# EAGLE design ch340g-esp32 (EAGLE 9.6.2)
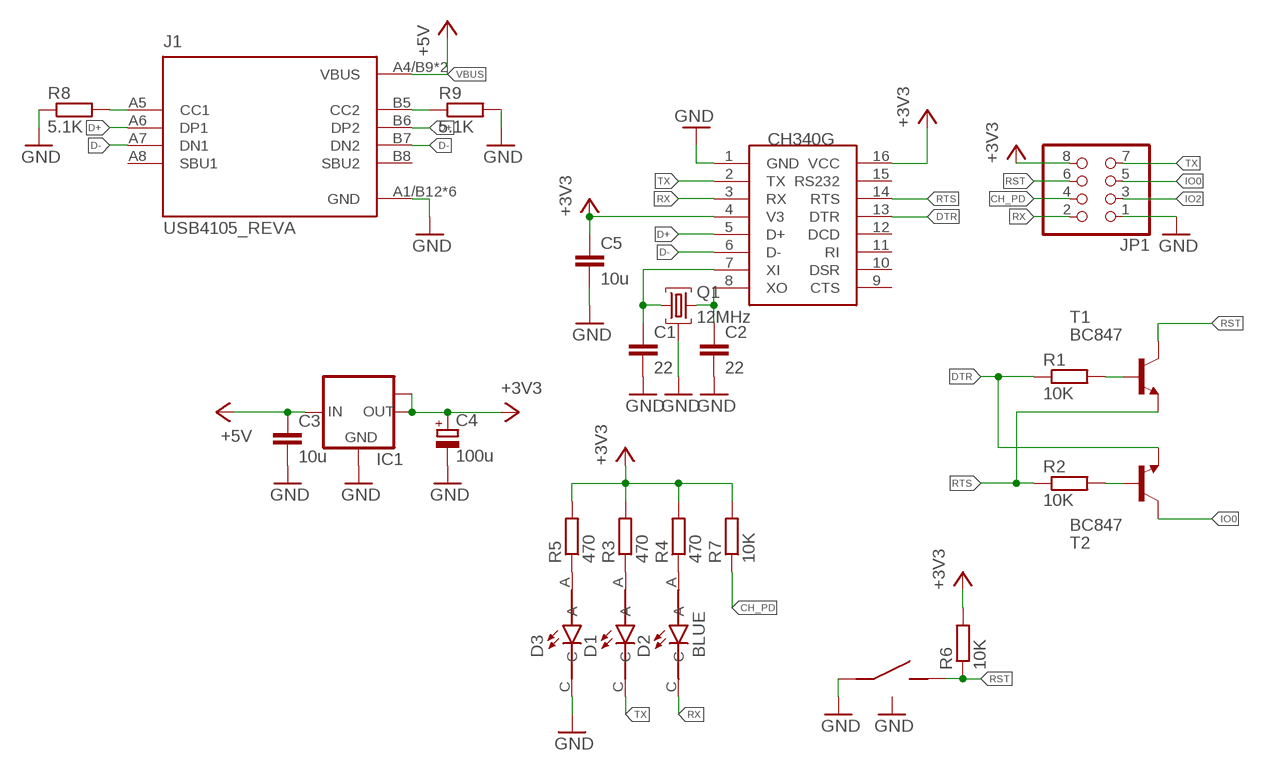
[diagram p0: schematic, sheet 1]

## Parts
BTN1  TS36CA-0.7  [SMD]
C1  22  C-EUC0603  [C0603]
C2  22  C-EUC0603  [C0603]
C3  10u  C-EUC0603  [C0603]
C4  100u  CPOL-EUB/3528-21W  [B/3528-21W]
C5  10u  C-EUC0603  [C0603]
D1  BLUE  597-5311-402F  [LEDC2012X70N]
D2  BLUE  597-5311-402F  [LEDC2012X70N]
D3  GREEN  597-5311-402F  [LEDC2012X70N]
IC1  LM1117MPX-3.3  [SOT223]
J1  USB4105_REVA  [GCT_USB4105_REVA]
JP1  PINHD-2X4  [2X04]
Q1  12MHz  YSX321SL  [SMD3225]
R1  10K  R-EU_R0603  [R0603]
R2  10K  R-EU_R0603  [R0603]
R3  470  R-EU_R0603  [R0603]
R4  470  R-EU_R0603  [R0603]
R5  470  R-EU_R0603  [R0603]
R6  10K  R-EU_R0603  [R0603]
R7  10K  R-EU_R0603  [R0603]
R8  5.1K  R-EU_R0603  [R0603]
R9  5.1K  R-EU_R0603  [R0603]
T1  BC847  [SOT23]
T2  BC847  [SOT23]
U1  CH340G  [SOIC16]

## Nets
+3V3 [VCC]: C4.+ C5.1 IC1.2(OUT) IC1.TAB(OUT1) JP1.8 R3.2 R4.2 R5.2 R6.2 R7.2 U1.4(V3) U1.16(VCC)
CH_PD: JP1.4 R7.1
D+: J1.A6(DP1) J1.B6(DP2) U1.5(D+)
D-: J1.A7(DN1) J1.B7(DN2) U1.6(D-)
DTR: R1.1 T2.2(E) U1.13(DTR)
GND [GND]: BTN1.A(CASE) BTN1.B(CASE) BTN1.C C1.2 C2.2 C3.2 C4.- C5.2 D3.C IC1.1(GND) J1.A1/B12(GND) J1.B1/A12(GND) J1.G1(GND) J1.G2(GND) J1.G3(GND) J1.G4(GND) JP1.1 Q1.P$2(CASE) Q1.P$4(CASE) R8.1 R9.2 U1.1(GND)
IO0: JP1.5 T2.3(C)
IO2: JP1.3
N$1: C2.1 Q1.P$3 U1.8(XO)
N$2: C1.1 Q1.P$1 U1.7(XI)
N$3: R1.2 T1.1(B)
N$4: R2.2 T2.1(B)
N$5: D1.A R3.1
N$6: D3.A R5.1
N$7: J1.A5(CC1) R8.2
N$8: J1.B5(CC2) R9.1
N$12: D2.A R4.1
RST: BTN1.D JP1.6 R6.1 T1.3(C)
RTS: R2.1 T1.2(E) U1.14(RTS)
RX: D2.C JP1.2 U1.3(RX)
TX: D1.C JP1.7 U1.2(TX)
VBUS [VCC]: C3.1 IC1.3(IN) J1.A4/B9(VBUS) J1.B4/A9(VBUS) ; supply symbol labelled +5V
Unconnected: J1.A8(SBU1) J1.B8(SBU2) U1.9(CTS) U1.10(DSR) U1.11(RI) U1.12(DCD) U1.15(RS232)

## Library data of the parts
BTN1 = SMD Tact:TS36CA-0.7: SHOU HAN TS36CA-0.7; LCSC#: C412365; MF: SHOU HAN; MP: TS36CA-0.7
C1-C3 C5 = rcl:C-EU: CAPACITOR, European symbol; SPICEPREFIX: C
C4 = rcl:CPOL-EU: POLARIZED CAPACITOR, European symbol; SPICEPREFIX: C
D1-D3 = 597-5311-402F:597-5311-402F: LED Uni-Color Green 560nm 2-Pin Chip 0805(2012Metric) Strip; AVAILABILITY: Unavailable; DESCRIPTION: LED Uni-Color Green 560nm 2-Pin Chip 0805_2012Metric_ Tape; MF: Dialight; MP: 597-5311-402F; PACKAGE: 0805 Dialight; PRICE: None
IC1 = lm1117:LM1117MPX-*
J1 = USB4105_REVA:USB4105_REVA: USB Type C Receptacle for USB 2.0 SMT Type, PCB Top Mount; AVAILABILITY: Unavailable; DESCRIPTION: USB-C (USB TYPE-C) USB 2.0 Receptacle Connector 24 (16+8 Dummy) Position Surface Mount, Right Angle; Through Hole; MF: Global Connector Technology; MP: USB4105; PACKAGE: Package; PRICE: None
JP1 = pinhead:PINHD-2X4: PIN HEADER
Q1 = crystal:YSX321SL: SMD Crystal Resonator Yangxing Tech X322512MSB4SI Passive SMD Crystal; MF: Yangxing Tech; MP: X322512MSB4SI; PACKAGE: SMD3225
R1-R9 = rcl:R-EU_: RESISTOR, European symbol; SPICEPREFIX: R
T1 T2 = transistor:BC847: NPN TRANSISTOR
U1 = ch340g:CH340G

## Net classes
0 default: width 0.25 mm
1 GND: width 0.4 mm
2 VCC: width 0.4 mm

## Board
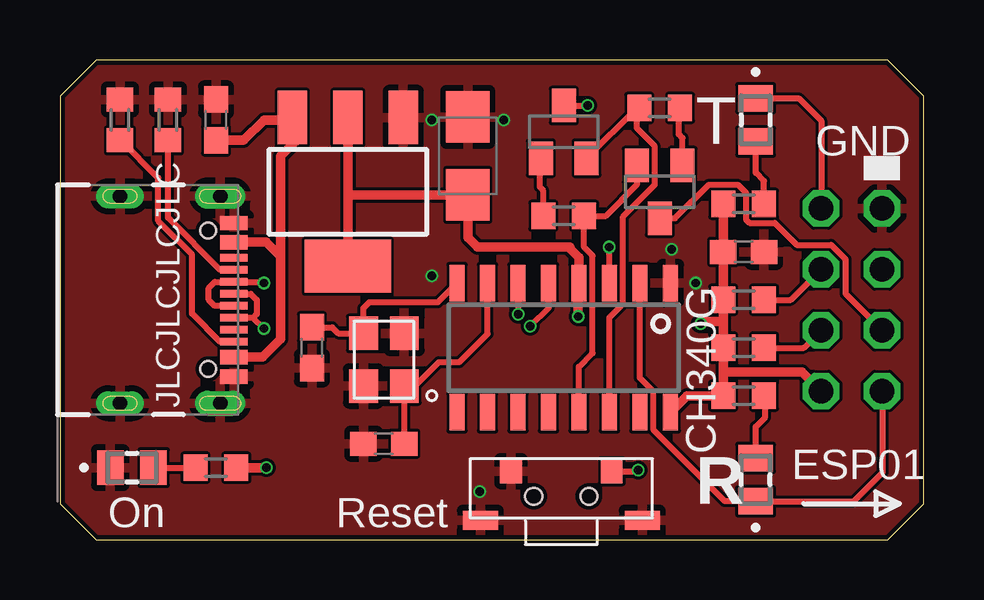
[diagram p1: board, top side]
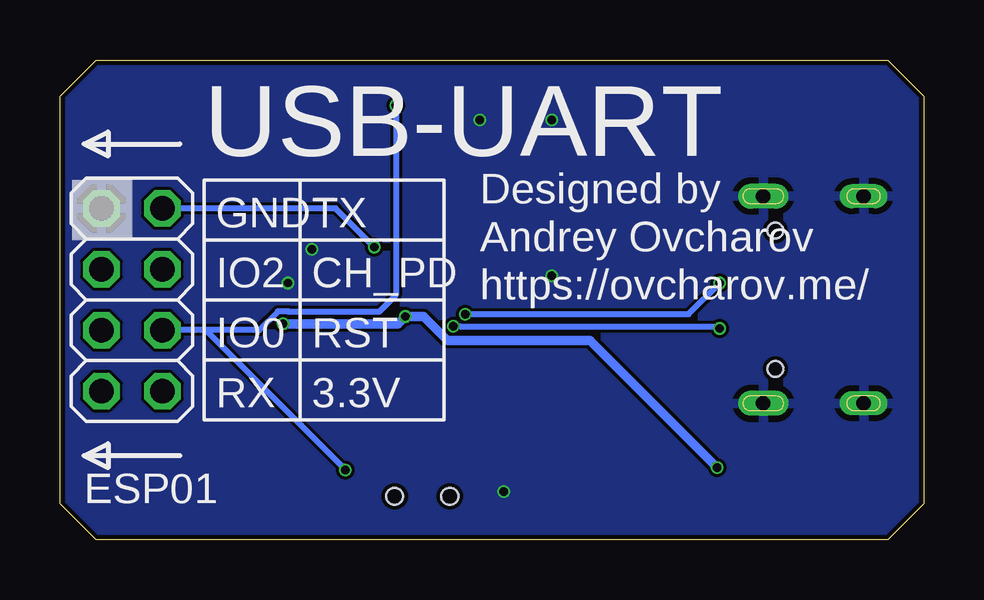
[diagram p2: board, bottom side, seen from below]

Size 36 x 20 mm. Coordinates in mm from the lower left corner, seen from the top.
Outline: 34.5,0 36,1.5 36,18.5 34.5,20 1.5,20 0,18.5 0,1.5 1.5,0 34.5,0
Copper layers (1*16): Top 0.035mm / dielectric 1.5mm / Bottom 0.035mm
Design rules "jlcpcb-2layer": minimum track width 5mil, minimum drill 0.3mm, track to track 5mil, track to pad 5mil, pad to pad 5mil, via to via 5mil, smd to smd 5mil, copper to edge 0.2mm, drill to drill 6mil, minimum pad ring 3mil, minimum via ring 3mil, stop-mask expansion 4mil, vias tented up to drill 0.5mm, thermal gap 10mil

### Footprints (pad centres in the part's own frame; a part is rotated, then mirrored left to right if it is on the bottom)
SMD = smd 1.45 x 0.8: A -3.375,-1; B 3.375,-1 | smd 0.9 x 1: C -2.1,1.05; D 2.1,1.05 | hole 0.7: -1.15,0; 1.15,0
C0603 = smd 1.1 x 1: 1 -0.85,0; 2 0.85,0
B/3528-21W = smd 2.15 x 1.8: + 1.625,0; - -1.625,0
LEDC2012X70N = smd 1.1 x 1.45: A 0.9,0; C -0.9,0
SOT223 = smd 1.219 x 2.235: 1 -2.311,-3.099; 2 0,-3.099; 3 2.311,-3.099 | smd 3.6 x 2.2: TAB 0,3.099
GCT_USB4105_REVA = smd 0.6 x 1.15: A1/B12 -3.2,4.755; A4/B9 -2.4,4.755; B1/A12 3.2,4.755; B4/A9 2.4,4.755 | smd 0.3 x 1.15: A5 -1.25,4.755; A6 -0.25,4.755; A7 0.25,4.755; A8 1.25,4.755; B5 1.75,4.755; B6 0.75,4.755; B7 -0.75,4.755; B8 -1.75,4.755 | drill 0.6 pad 1 long: G1 -4.32,0; G2 4.32,0 | drill 0.6 pad 1.05 long: G3 -4.32,4.18; G4 4.32,4.18 | hole 0.65: 2.89,3.68; -2.89,3.68
2X04 = drill 1.016 octagon: 1 -3.81,-1.27; 2 -3.81,1.27; 3 -1.27,-1.27; 4 -1.27,1.27; 5 1.27,-1.27; 6 1.27,1.27; 7 3.81,-1.27; 8 3.81,1.27
SMD3225 = smd 1.4 x 1.2: P$1 -1.1,-0.85; P$2 1.1,-0.85; P$3 1.1,0.85; P$4 -1.1,0.85
R0603 = smd 1 x 1.1: 1 -0.85,0; 2 0.85,0
SOT23 = smd 1 x 1.4: 1 -0.95,-1.1; 2 0.95,-1.1; 3 0,1.1
SOIC16 = smd 0.635 x 1.524: 1 -4.445,-2.695; 2 -3.175,-2.695; 3 -1.905,-2.695; 4 -0.635,-2.695; 5 0.635,-2.695; 6 1.905,-2.695; 7 3.175,-2.695; 8 4.445,-2.695; 9 4.445,2.695; 10 3.175,2.695; 11 1.905,2.695; 12 0.635,2.695; 13 -0.635,2.695; 14 -1.905,2.695; 15 -3.175,2.695; 16 -4.445,2.695

### Placement (x,y rotation side)
BTN1  20.9,1.8 0 top
C1  13.5,4 180 top
C2  10.5,8 270 top
C3  6.5,17.5 90 top
C4  17,16 270 top
C5  28.5,12 0 top
D1  29,2.5 90 top
D2  29,17.5 270 top
D3  3,3 0 top
IC1  12,14.5 180 top
J1  2.5,10 270 top
JP1  33,10 270 bottom
Q1  13.5,7.5 90 top
R1  21,13.5 180 top
R2  25,18 0 top
R3  28.5,6 180 top
R4  28.5,14 180 top
R5  6.5,3 0 top
R6  28.5,8 180 top
R7  28.5,10 180 top
R8  4.5,17.5 270 top
R9  2.5,17.5 90 top
T1  21,17 0 top
T2  25,14.5 180 top
U1  21,8 180 top

### Tracks (layer width: path | path; a pad name or v marks a point on that pad's centre or on a via)
+3V3  (via drill 0.35)
  Top 0.4: IC1.2 12,14.4 | 12,14.4 IC1.TAB | 17.45,12.2 21.2,12.2 21.64,11.77 U1.4 21.6,10.66 v21.6,9.3 | 17.45,12.2 17.4,12.2 17,12.6 C4.+ 12.03,14.38 12,14.4 | R5.2 v8.6,3 | R4.2 C5.1 R7.2 27.65,9.1 | 27.65,9.1 R6.2 27.65,7 | 27.65,7 R3.2 26.14,6 U1.16 | JP1.8 30.92,7 27.65,7 | 27.65,9.1 26.8,9.1 v26.7,9 | 21.25,12.2 17.45,12.2
  Bottom 0.4: v8.6,3 13.91,8.31 19.84,8.31 20.83,9.3 v21.6,9.3 21.9,9 v26.7,9
CH_PD
  Top 0.25: R7.1 30.46,10 JP1.4
D+  (via drill 0.35)
  Top 0.25: J1.A6 7.95,10.25 8.2,10 8.2,9.4 8.05,9.25 | 8.05,9.25 J1.B6 | U1.5 20.36,9.66 v19.6,8.9 | v8.5,8.8 8.05,9.25
  Bottom 0.25: v19.6,8.9 19.33,8.9 19.31,8.89 8.59,8.89 v8.5,8.8
D-  (via drill 0.35)
  Top 0.25: J1.A7 6.45,9.75 6.2,10 6.2,10.5 6.45,10.75 J1.B7 8.45,10.75 v8.5,10.7 | U1.6 v19.09,9.4 v19.1,9.4
  Bottom 0.25: v19.1,9.4 9.8,9.4 v8.5,10.7
DTR
  Top 0.25: T2.2 24.05,14.8 22.75,13.5 R1.1 21.85,12.19 22.2,11.84 22.2,7.78 21.64,7.21 U1.13
GND  (via drill 0.35)
  other vias: 26.5,10.7 25.5,12.1 15.5,11 15.5,17.5 18.5,17.5 17.5,2
  pour Top: 0,0 36.4,0 36.4,20.2 0,20.2
  pour Bottom: 0,0 36.5,0 36.5,20 0,20
IO0
  Top 0.25: T2.3 25.64,13.4 27.05,14.8 28.25,14.8 28.6,14.46 28.6,13.35 28.75,13.2 29.8,13.2 30.72,12.28 32.15,12.28 32.74,11.69 32.74,10.26 JP1.5
N$1
  Top 0.25: C2.1 11.35,8.85 11.6,8.6 Q1.P$3 12.65,9.65 12.9,9.9 15.76,9.9 U1.8
N$2
  Top 0.25: C1.1 Q1.P$1 14.8,6.4 15.8,7.4 16.65,7.4 17.82,8.57 U1.7
N$3
  Top 0.25: R1.2 20.15,14.55 20,14.7 20,15.85 T1.1
N$4
  Top 0.25: T2.1 25.95,16.75 25.8,16.9 25.8,17.95 R2.2
N$5
  Top 0.25: R3.1 29.4,5.95 29.4,5.1 29,4.7 D1.A
N$6
  Top 0.25: D3.A R5.1
N$7
  Top 0.25: J1.A5 6.68,11.25 4.5,13.42 R8.2
N$8
  Top 0.25: J1.B5 6.68,8.25 5.5,9.42 5.5,11.89 4.1,13.29 4.1,15.08 2.53,16.65 R9.1
N$12
  Top 0.25: R4.1 29.35,14.95 29,15.3 D2.A
RST  (via drill 0.35)
  Top 0.25: R6.1 31,8 JP1.6 | BTN1.D 24.05,2.85 v24.1,2.9 | T1.3 v22,18.1
  Bottom 0.25: v24.1,2.9 29.93,8.73 | 29.93,8.73 JP1.6 | v22,18.1 22,10.2 22.7,9.5 26.47,9.5 26.49,9.51 26.91,9.51 27.7,8.73 29.93,8.73
RTS
  Top 0.25: T1.2 24.05,18 | 24.05,18 R2.1 | U1.14 22.91,9.26 23.47,9.83 23.47,13.47 24.8,14.8 24.8,16.4 24.05,17.16 24.05,18
RX  (via drill 0.35)
  Top 0.25: D2.C 30.8,18.4 31.73,17.47 JP1.2 | U1.3 v22.9,12.2
  Bottom 0.25: v22.9,12.2 24.51,13.81 JP1.2
TX
  Top 0.25: JP1.7 34.3,6.16 34.3,2.8 33.1,1.6 D1.C 27.71,1.6 24.74,4.57 24.74,6.17 24.18,6.74 U1.2
VBUS
  Top 0.4: J1.B4/A9 7.28,7.62 8.46,7.62 9.2,8.37 9.2,11.8 | 9.2,11.8 8.6,12.4 J1.A4/B9 | 9.2,11.8 9.2,16 9.8,16.6 9.8,17.49 9.79,17.5 | 9.79,17.5 IC1.3 | C3.1 7.65,16.65 8.5,17.5 9.79,17.5

### Text on the board
tPlace: T | GND | R | ESP01
tNames: JLCJLCJLCJLC | On | Reset
bNames: USB-UART | Designed by | TX | GND | Andrey Ovcharov | https://ovcharov.me/ | CH_PD | IO2 | RST | IO0 | 3.3V | RX | ESP01